# Altium project 组6-最终系统PCB.PrjPcb
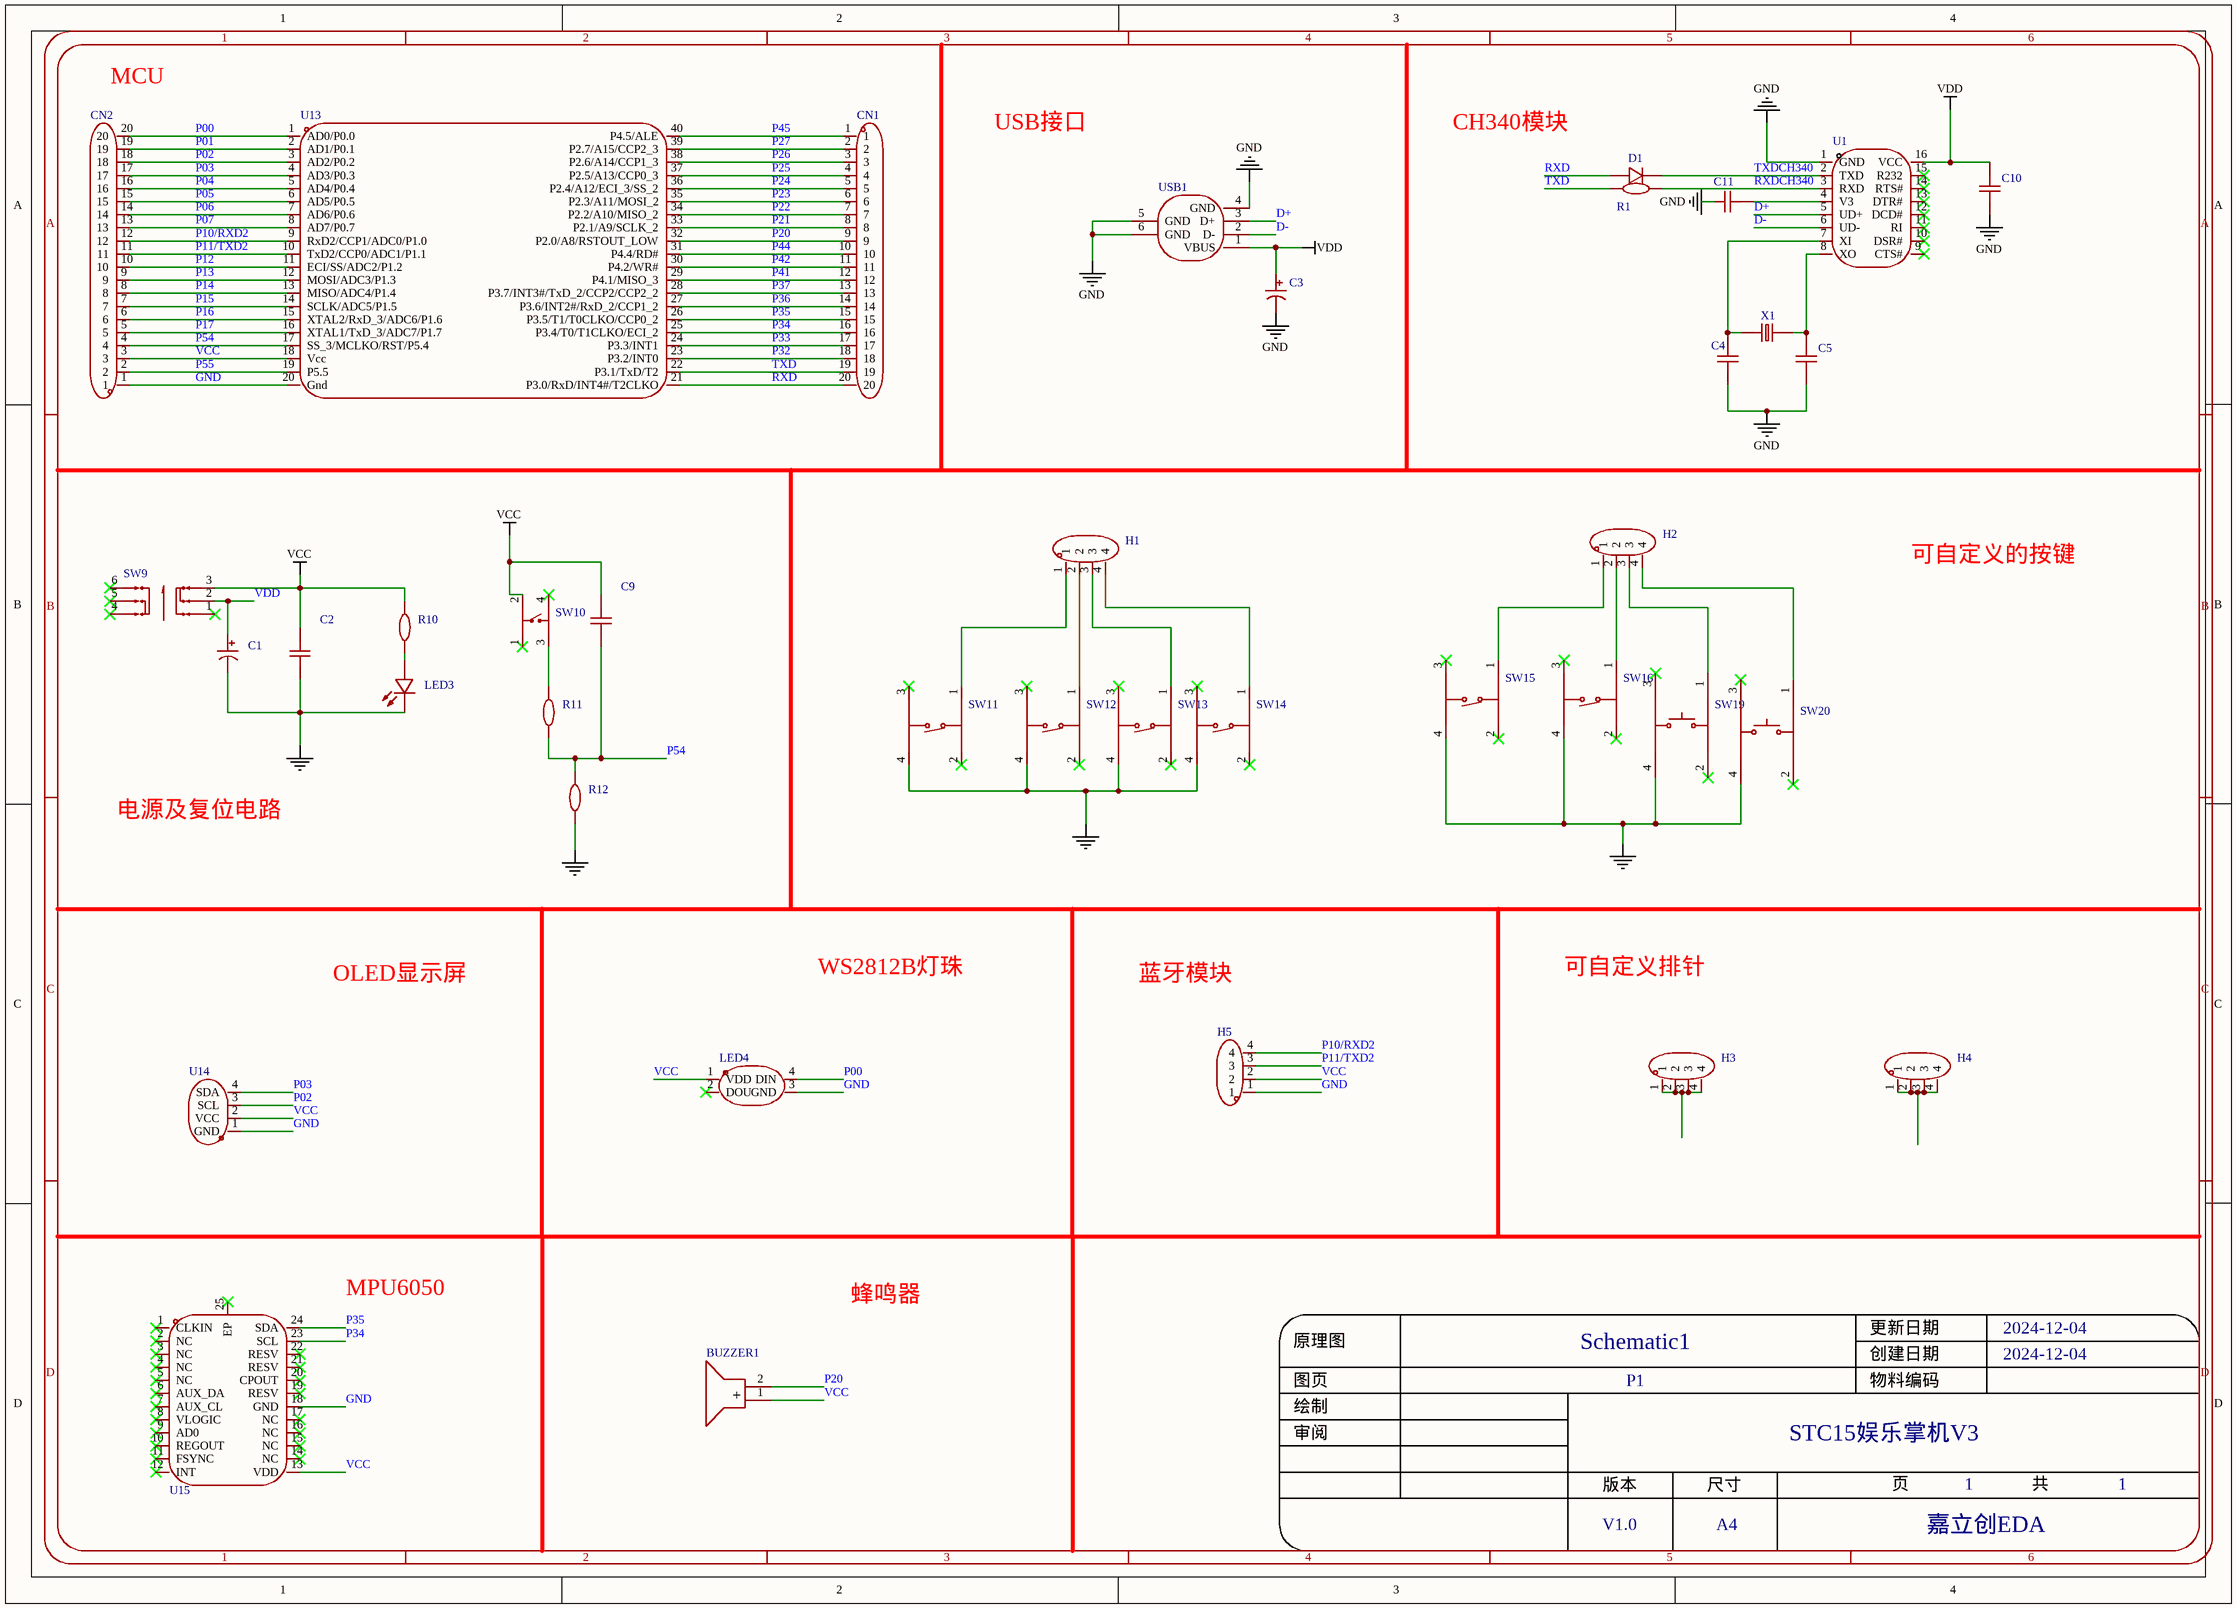
[diagram p0: P1.schdoc]
1 sheet, 39 parts. Net scope: global (net labels, ports and power ports of the same name join across sheets).
Board file: PCB1.pcbdoc

## Sheet P1.schdoc
size 431 x 309 mm; Symbol: Sheet-Symbol_A4; Device: Sheet-Symbol_A4; Company: 嘉立创EDA; Version: V1.0; Page Size: A4; @Project Name: STC15娱乐掌机V3; @Page Count: 1; @Update Date: 2024-12-04; @Create Date: 2024-12-04; @Schematic Name: Schematic1; @Page No: 1; @Page Name: P1; @Board Name: Board1; @Create Time: 14:28:36; @Update Time: 22:28:37; Width: 1655; Height: 1170; Region Start: 1; X Region Count: 6; Y Region Count: 4; Blade Width: 10; Title Block Position: 3

### Parts
BUZZER1  3kHz  [BUZ-TH_BD9.0-P5.00-D0.6-FD]  (value not drawn)
C1  220uF  [CAP-TH_BD6.3-P2.50-D1.0-FD]  (value not drawn)
C2  0.1uF  [CAP-TH_L5.0-W2.5-P5.08-D0.7]  (value not drawn)
C3  220uF/16V  [CAP-TH_BD6.3-P2.50-D1.0-FD]  (value not drawn)
C4  30pF  [CAP-TH_L5.0-W2.5-P2.54-D0.7]  (value not drawn)
C5  30pF  [CAP-TH_L5.0-W2.5-P2.54-D0.7]  (value not drawn)
C9  1uF  [CAP-TH_L5.0-W2.5-P5.08-D0.7]  (value not drawn)
C10  0.1uF/50V  [CAP-TH_L5.0-W2.5-P2.54-D0.7]  (value not drawn)
C11  0.1uF/50V  [CAP-TH_L5.0-W2.5-P2.54-D0.7]  (value not drawn)
CN1  1x20PIN  [hdr-th_20p-p2.54-v-m-4]  (value not drawn)
CN2  1x20PIN  [hdr-th_20p-p2.54-v-m-4]  (value not drawn)
D1  1N4148  [DO-35_BD2.0-L4.0-P8.00-D0.5-FD]  (value not drawn)
H1  PZ254V-11-04P  [HDR-TH_4P-P2.54-V-M]  (value not drawn)
H2  PZ254V-11-04P  [HDR-TH_4P-P2.54-V-M]  (value not drawn)
H3  PZ254V-11-04P  [HDR-TH_4P-P2.54-V-M]  (value not drawn)
H4  PZ254V-11-04P  [HDR-TH_4P-P2.54-V-M]  (value not drawn)
H5  蓝牙模块  [HDR-TH_4P-P2.54-V-M]  (value not drawn)
LED3  LED1  [LED-TH_BD4.0-P2.50-RD]  (value not drawn)
LED4  WS2812B  [LED-SMD_4P-L5.0-W5.0-BL_XL-5050RGBC]  (value not drawn)
R1  510  [RES-TH_BD1.7-L3.5-P7.50-D0.5]  (value not drawn)
R10  510Ω  [RES-TH_BD2.3-L3.7-P7.70-D0.9]  (value not drawn)
R11  510Ω  [RES-TH_BD2.3-L3.7-P7.70-D0.9]  (value not drawn)
R12  10kΩ  [RES-TH_BD2.3-L3.7-P7.70-D0.9]  (value not drawn)
SW9  XKB8080-Z  [SW-TH_6P-L8.0-W8.0-P2.50]  (value not drawn)
SW10  KH-6X6X4.3H-TJ  [SW-TH_4P-L6.0-W6.0-P4.50-LS6.5]  (value not drawn)
SW11  B3F-4005  [SW-TH_4P-L12.0-W12.0-P5.00-LS12.5-EH]  (value not drawn)
SW12  B3F-4005  [SW-TH_4P-L12.0-W12.0-P5.00-LS12.5-EH]  (value not drawn)
SW13  B3F-4005  [SW-TH_4P-L12.0-W12.0-P5.00-LS12.5-EH]  (value not drawn)
SW14  B3F-4005  [SW-TH_4P-L12.0-W12.0-P5.00-LS12.5-EH]  (value not drawn)
SW15  B3F-4005  [SW-TH_4P-L12.0-W12.0-P5.00-LS12.5-EH]  (value not drawn)
SW16  B3F-4005  [SW-TH_4P-L12.0-W12.0-P5.00-LS12.5-EH]  (value not drawn)
SW19  TC-1102-B-A-B  [SW-TH_4P-L6.0-W6.0-P4.50-LS6.5]  (value not drawn)
SW20  TC-1102-B-A-B  [SW-TH_4P-L6.0-W6.0-P4.50-LS6.5]  (value not drawn)
U1  CH340G  [SOIC-16_L9.9-W3.9-P1.27-LS6.0-BL]  (value not drawn)
U13  STC15F2K60S2-28I-PDIP40  [DIP-40_L52.3-W13.9-P2.54-LS15.2-BL]  (value not drawn)
U14  OLED  [OLED-TH_L27.8-W27.2-P2.54_C9900033791]  (value not drawn)
U15  MPU-6050  [QFN-24_L4.0-W4.0-P0.50-BL-EP2.7]  (value not drawn)
USB1  USB-B01  [USB-B-TH_USB-B01]  (value not drawn)
X1  12MHz  [HC-49US_L11.5-W4.5-P4.88]  (value not drawn)

### Nets
GND: C1.2 C2.1 C3.2 C4.1 C5.1 C10.1 C11.1 CN2.1 H5.1 LED3.1(C) LED4.3(GND) R12.1 SW11.4 SW12.4 SW13.4 SW14.4 SW15.4 SW16.4 SW19.4 SW20.4 U1.1(GND) U13.20(Gnd) U14.1(GND) U15.18(GND) USB1.4(GND) USB1.5(GND) USB1.6(GND)
VCC: BUZZER1.1(+) C2.2 C9.2 CN2.3 H5.2 LED4.1(VDD) R10.2 SW9.3 SW10.2 U13.18(Vcc) U14.2(VCC) U15.13(VDD)
VDD: C1.1 C3.1 C10.2 SW9.2 U1.16(VCC) USB1.1(VBUS)
D+: U1.5(UD+) USB1.3(D+)
D-: U1.6(UD-) USB1.2(D-)
P00: CN2.20 LED4.4(DIN) U13.1(AD0/P0.0)
P01: CN2.19 U13.2(AD1/P0.1)
P02: CN2.18 U13.3(AD2/P0.2) U14.3(SCL)
P03: CN2.17 U13.4(AD3/P0.3) U14.4(SDA)
P04: CN2.16 U13.5(AD4/P0.4)
P05: CN2.15 U13.6(AD5/P0.5)
P06: CN2.14 U13.7(AD6/P0.6)
P07: CN2.13 U13.8(AD7/P0.7)
P10/RXD2: CN2.12 H5.4 U13.9(RxD2/CCP1/ADC0/P1.0)
P11/TXD2: CN2.11 H5.3 U13.10(TxD2/CCP0/ADC1/P1.1)
P12: CN2.10 U13.11(ECI/SS/ADC2/P1.2)
P13: CN2.9 U13.12(MOSI/ADC3/P1.3)
P14: CN2.8 U13.13(MISO/ADC4/P1.4)
P15: CN2.7 U13.14(SCLK/ADC5/P1.5)
P16: CN2.6 U13.15(XTAL2/RxD_3/ADC6/P1.6)
P17: CN2.5 U13.16(XTAL1/TxD_3/ADC7/P1.7)
P20: BUZZER1.2(-) CN1.9 U13.32(P2.0/A8/RSTOUT_LOW)
P21: CN1.8 U13.33(P2.1/A9/SCLK_2)
P22: CN1.7 U13.34(P2.2/A10/MISO_2)
P23: CN1.6 U13.35(P2.3/A11/MOSI_2)
P24: CN1.5 U13.36(P2.4/A12/ECI_3/SS_2)
P25: CN1.4 U13.37(P2.5/A13/CCP0_3)
P26: CN1.3 U13.38(P2.6/A14/CCP1_3)
P27: CN1.2 U13.39(P2.7/A15/CCP2_3)
P32: CN1.18 U13.23(P3.2/INT0)
P33: CN1.17 U13.24(P3.3/INT1)
P34: CN1.16 U13.25(P3.4/T0/T1CLKO/ECI_2) U15.23(SCL)
P35: CN1.15 U13.26(P3.5/T1/T0CLKO/CCP0_2) U15.24(SDA)
P36: CN1.14 U13.27(P3.6/INT2#/RxD_2/CCP1_2)
P37: CN1.13 U13.28(P3.7/INT3#/TxD_2/CCP2/CCP2_2)
P41: CN1.12 U13.29(P4.1/MISO_3)
P42: CN1.11 U13.30(P4.2/WR#)
P44: CN1.10 U13.31(P4.4/RD#)
P45: CN1.1 U13.40(P4.5/ALE)
P54: C9.1 CN2.4 R11.1 R12.2 U13.17(SS_3/MCLKO/RST/P5.4)
P55: CN2.2 U13.19(P5.5)
RXD: CN1.20 D1.1(A) U13.21(P3.0/RxD/INT4#/T2CLKO)
RXDCH340: R1.2 U1.3(RXD)
TXD: CN1.19 R1.1 U13.22(P3.1/TxD/T2)
TXDCH340: D1.2(K) U1.2(TXD)
NetC4_2: C4.2 U1.7(XI) X1.1
NetC5_2: C5.2 U1.8(XO) X1.2
NetC11_2: C11.2 U1.4(V3)
NetH1_1: H1.1 SW11.1
NetH1_2: H1.2 SW12.1
NetH1_3: H1.3 SW13.1
NetH1_4: H1.4 SW14.1
NetH2_1: H2.1 SW15.1
NetH2_2: H2.2 SW16.1
NetH2_3: H2.3 SW19.1
NetH2_4: H2.4 SW20.1
NetH3_1: H3.1 H3.2 H3.3 H3.4
NetH4_1: H4.1 H4.2 H4.3 H4.4
NetLED3_2: LED3.2(A) R10.1
NetR11_2: R11.2 SW10.3

Not connected (* = marked no-connect by the designer): LED4 2(DOU)*; SW9 1* 4* 5* 6*; SW10 1* 4*; SW11 2* 3*; SW12 2* 3*; SW13 2* 3*; SW14 2* 3*; SW15 2* 3*; SW16 2* 3*; SW19 2* 3*; SW20 2* 3*; U1 9(CTS#)* 10(DSR#)* 11(RI)* 12(DCD#)* 13(DTR#)* 14(RTS#)* 15(R232)*; U15 1(CLKIN)* 2(NC)* 3(NC)* 4(NC)* 5(NC)* 6(AUX_DA)* 7(AUX_CL)* 8(VLOGIC)* 9(AD0)* 10(REGOUT)* 11(FSYNC)* 12(INT)* 14(NC)* 15(NC)* 16(NC)* 17(NC)* 19(RESV)* 20(CPOUT)* 21(RESV)* 22(RESV)* 25(EP)*

### Notes on the sheet
- (near CN2) MCU
- USB接口
- CH340模块
- 可自定义的按键
- 电源及复位电路
- WS2812B灯珠
- 可自定义排针
- OLED显示屏
- 蓝牙模块
- MPU6050
- 蜂鸣器
- 1
- 2
- 3
- 4
- 5
- 6
- A
- B
- C
- D
- 原理图
- Schematic1
- 创建日期
- 更新日期
- 2024-12-04
- 审阅
- 绘制
- 图页
- P1
- 物料编码
- STC15娱乐掌机V3
- 版本
- 尺寸
- 页
- 共
- V1.0
- A4
- 嘉立创EDA

### Library data of the parts
BUZZER1 = HNB09A03: 驱动方式:有源(内含驱动线路);构造类型:电磁式;频率:3kHz;声压(SPL):85dB@10cm;; Manufacturer: 华能; Add into BOM: yes; Technology Type: 电磁式; Operating Voltage: 1.5V~4.5V; Current Consumption: 30mA; Symbol: HNB09A03; Device: HNB09A03; LCSC Part Name: 电磁式有源一体蜂鸣器HNB09A03; Supplier Part: C96102; Manufacturer Part: HNB09A03; Supplier Footprint: 插件,D=9mm; JLCPCB Part Class: 扩展库; Datasheet: https://atta.szlcsc.com/upload/public/pdf/source/20170522/1495448326172.pdf; Supplier: LCSC; Convert to PCB: yes; Oscillator Circuit: 有源(内含驱动线路); Value: 3kHz; Sound Pressure Level (SPL): 85dB@10cm; Diameter (φD): 9mm; Length: -; Width: -; Height: 5.5mm; Operating Temperature: -20℃~+70℃
C1 = ZF227M010E07RR0VH4FP0: 容值:220uF;精度:±20%;额定电压:10V;纹波电流:-;等效串联电阻:-;; Manufacturer: CX(承兴); Symbol: 220uF 10V 6.3*7; Add into BOM: yes; Tolerance: ±20%; Rated Voltage: 10V; φD: 6.3mm; L: 7mm; Lifetime @ Temp: 1000hrs@105℃; Device: ZF227M010E07RR0VH4FP0; Supplier: LCSC; Manufacturer Part: ZF227M010E07RR0VH4FP0; Value: 220uF; Supplier Part: C43331; JLCPCB Part Class: 扩展库; LCSC Part Name: 220uF ±20% 10V 黑; Supplier Footprint: 插件,D6.3xL7mm; Datasheet: https://atta.szlcsc.com/upload/public/pdf/source/20211027/BC8F7E368CF510796C09133063E82C9C.pdf; Convert to PCB: yes; Ripple Current: -; Equivalent Series Resistance(ESR): -; Lead Spacing: 2.5mm; Operating Temperature: -40℃~+105℃
C2 C9 = CC1H330JC74DCH4B10MN: 容值:33pF;精度:±5%;额定电压:50V;温度系数:NP0;; Manufacturer: Dersonic(德尔创); Add into BOM: yes; Tolerance: ±5%; Voltage Rated: 50V; Temperature Coefficient: NP0; φD: 4.7mm; Body Thickness: 2.2mm; Symbol: CC1H330JC74DCH4B10MN; Device: CC1H330JC74DCH4B10MN; LCSC Part Name: 33pF ±5% 50V; Supplier Part: C254101; Manufacturer Part: CC1H330JC74DCH4B10MN; Supplier Footprint: 插件,P=5.08mm; JLCPCB Part Class: 扩展库; Datasheet: https://atta.szlcsc.com/upload/public/pdf/source/20200826/C254101_16B526CCB578B7B7F57569795E2616C1.pdf; Supplier: LCSC; Convert to PCB: yes; Lead Spacing: 5.08mm
  C2: Value: 0.1uF
  C9: Value: 1uF
C3 = 220uF/16V: Manufacturer: Lelon; Manufacturer Part: SS-101M1ASA-0605; Symbol: 100uF; Add into BOM: yes; Device: 220uF/16V; Supplier: LCSC; Supplier Part: C311676; JLCPCB Part Class: Extended Part; Convert to PCB: yes; Origin Footprint: CAP-TH_BD6.3-P2.50-D1.0-FD; Design Item ID: 100uF; Library Name: 51单片机SCH库 -v1
C4 C5 = 30pF: ±5% 50V  瓷片电容 直插; Manufacturer: FH; Manufacturer Part: CC4-0805N300J500F3; Add into BOM: yes; Symbol: 30pF; Device: 30pF; Supplier: LCSC; Supplier Part: C94716; JLCPCB Part Class: Extended Part; Convert to PCB: yes; Origin Footprint: CAP-TH_L5.0-W2.5-P2.54-D0.7; Design Item ID: 30pF; Library Name: 51单片机SCH库 -v1
C10 C11 = 0.1uF/50V: ±5% 50V  瓷片电容 直插; Manufacturer: FH; Manufacturer Part: CC4-0805N300J500F3; Symbol: 30pF; Add into BOM: yes; Device: 0.1uF/50V; Supplier: LCSC; Supplier Part: C94716; JLCPCB Part Class: Extended Part; Convert to PCB: yes; Origin Footprint: CAP-TH_L5.0-W2.5-P2.54-D0.7; Design Item ID: 30pF; Library Name: 51单片机SCH库 -v1
CN1 CN2 = HC-PZ254-11.5L-1x20PZ: 插针结构:1x20P;间距:2.54mm;行距:-;圆针/方针:方针;安装类型:直插;排数:单排;总PIN位数:20P;额定电流:3A;配合针长度:6mm;塑高:2.5mm;端接针长度:3mm;触头材质:黄铜;触头镀层:金;工作温度范围:-40℃~+105℃;焊接温度(最大值):260℃;颜色:黑色;; Manufacturer: HC(虹成电子); Add into BOM: yes; Pin Structure: 1x20P; Pitch: 2.54mm; Circluar Pins/Square Pins: 方针; Current Rating (Max): 3A; Soldering Temperature(Max): 260℃; Symbol: hc-pz254-11.5l-1x20pz; Device: HC-PZ254-11.5L-1x20PZ; LCSC Part Name: 间距2.54mm 1x20Pin 直插 H2.5 L11.5; Supplier Part: C27985199; Manufacturer Part: 1x20PIN; Supplier Footprint: 插件,P=2.54mm; JLCPCB Part Class: 扩展库; Datasheet: https://atta.szlcsc.com/upload/public/pdf/source/20240710/EBB73ACECFFBB056933A78571A4AC703.pdf; Supplier: LCSC; Convert to PCB: yes; Row Spacing: -; Mounting Type: 直插; Number of Rows: 单排; Number of Pins: 20P; Length of Mating Pin: 6mm; Insulation Height: 2.5mm; Length of End Connection Pin: 3mm; Contact Material: 黄铜; Contact Plating: 金; Operating Temperature Range: -40℃~+105℃; Color: 黑色
D1 = 1N4148: Manufacturer: ON Semicon; Add into BOM: yes; Symbol: 1N4148; Device: 1N4148; Supplier: LCSC; Supplier Part: C258182; Manufacturer Part: 1N4148; JLCPCB Part Class: Extended Part; Convert to PCB: yes; Origin Footprint: DO-35_BD2.0-L4.0-P8.00-D0.5-FD; Design Item ID: 1N4148; Library Name: 51单片机SCH库 -v1
H1-H5 = PZ254V-11-04P: 插针结构:1x4P;间距:2.54mm;行距:-;圆针/方针:方针;安装类型:直插;排数:单排;总PIN位数:4P;额定电流:3A;额定电压:250V;配合针长度:6mm;塑高:2.5mm;端接针长度:3mm;触头材质:-;工作温度范围:-40℃~+105℃;颜色:黑色;; Manufacturer: XFCN(兴飞); Symbol: PZ254V-11-04P_C2691448; Add into BOM: yes; Pin Structure: 1x4P; Pitch: 2.54mm; Circluar Pins/Square Pins: 方针; Current Rating (Max): 3A; Voltage Rating (Max): 250V; Device: PZ254V-11-04P; LCSC Part Name: 间距:2.54mm 1x4P 直插 方针; Supplier Part: C2691448; Supplier Footprint: 插件,P=2.54mm; JLCPCB Part Class: 扩展库; Datasheet: https://atta.szlcsc.com/upload/public/pdf/source/20200309/C492403_F9F19131791D08044AD4F84F8E751A34.pdf; Supplier: LCSC; Convert to PCB: yes; Row Spacing: -; Mounting Type: 直插; Number of Rows: 单排; Number of Pins: 4P; Length of Mating Pin: 6mm; Insulation Height: 2.5mm; Length of End Connection Pin: 3mm; Contact Material: -; Operating Temperature Range: -40℃~+105℃; Color: 黑色
  H1-H4: Manufacturer Part: PZ254V-11-04P
  H5: Manufacturer Part: 蓝牙模块
LED3 = 204-10SDRD/S530-A3/F182-68: -; Manufacturer: EVERLIGHT(亿光); Add into BOM: yes; Symbol: 204-10SDRD/S530-A3/F182-68; Device: 204-10SDRD/S530-A3/F182-68; Supplier: LCSC; Supplier Part: C473831; Manufacturer Part: LED1; JLCPCB Part Class: 扩展库; LCSC Part Name: 204-10SDRD/S530-A3/F182-68; Supplier Footprint: 插件; Convert to PCB: yes
LED4 = XL-5050RGBC-WS2812B: 5050七彩幻彩透明贴片LED灯珠 5050 幻彩透明四脚 ws2812B 内置驱动IC; Manufacturer: XINGLIGHT(成兴光); Add into BOM: yes; Symbol: XL-5050RGBC-WS2812B; Device: XL-5050RGBC-WS2812B; LCSC Part Name: XL-5050RGBC-WS2812B; Supplier Part: C2843785; Manufacturer Part: WS2812B; Supplier Footprint: SMD5050; JLCPCB Part Class: 扩展库; Datasheet: https://atta.szlcsc.com/upload/public/pdf/source/20240412/E1004CAA80592E31D08BFE019083806F.pdf; Supplier: LCSC; Convert to PCB: yes
R1 = 510/0.125W: 金属膜电阻/1/8W; Manufacturer: ResistorToday; Manufacturer Part: EWWR0008J4K70T9; Symbol: 4.7K; Add into BOM: yes; Device: 510/0.125W; Supplier: LCSC; Supplier Part: C349057; JLCPCB Part Class: Extended Part; Convert to PCB: yes; Origin Footprint: RES-TH_BD1.7-L3.5-P7.50-D0.5; Design Item ID: 4.7K; Library Name: 51单片机SCH库 -v1
R10-R12 = MF1/8W-330Ω±1%-OT52: 电阻类型:金属膜电阻;阻值:330Ω;精度:±1%;功率:125mW;温度系数:±350ppm/℃;; Manufacturer: VO(翔胜); Add into BOM: yes; Tolerance: ±1%; Overload Voltage (Max): 200V; Power(Watts): 125mW; Symbol: MF1/8W-330Ω±1%-OT52; Device: MF1/8W-330Ω±1%-OT52; LCSC Part Name: 金属膜电阻 330Ω ±1% 125mW; Supplier Part: C2848567; Manufacturer Part: MF1/8W-330Ω±1%-OT52; Supplier Footprint: 插件,D2.3xL3.7mm; JLCPCB Part Class: 扩展库; Supplier: LCSC; Convert to PCB: yes; Type: 金属膜电阻; Temperature Coefficient: ±350ppm/℃; Operating Temperature Range: -55℃~+155℃
  R10 R11: Value: 510Ω
  R12: Value: 10kΩ
SW9 = XKB8080-Z: 自锁/无锁:自锁;安装方式:直插;触点电流:100mA;额定电压 (AC):250V;额定电压 (DC):30V;带灯:不带;作用力:160gf;机械寿命:10万次;; Manufacturer: XKB Connectivity(中国星坤); Add into BOM: yes; Self Lock / No Lock: 自锁; Actuator Style: 矩形按钮; Contact Current: 100mA; Voltage Rating (AC): 250V; Voltage Rating (DC): 30V; Insulation Resistance: 100MΩ; Actuator/Cap Color: 蓝色; With Lamp: 不带; Pin Style: PC引脚; Operating Force: 160gf; Mechanical Life: 10万次; Symbol: XKB8080-Z; Device: XKB8080-Z; LCSC Part Name: 8*8 蓝白黑 自锁开关; Supplier Part: C318860; Manufacturer Part: XKB8080-Z; Supplier Footprint: 插件; JLCPCB Part Class: 扩展库; Datasheet: https://atta.szlcsc.com/upload/public/pdf/source/20200227/C318861_0CCDF4510CAD1098054D1FAD25282ED5.pdf; Supplier: LCSC; Convert to PCB: yes; IP Rating: -; Mounting Style: 直插; Operating Temperature: -15℃~+55℃
SW10 = KH-6X6X4.3H-TJ: 电路结构:单刀单掷;按钮形状:圆形按钮;作用力:260gf;安装方式:直插;开关长度:6mm;开关宽度:6mm;开关高度:4.3mm;带支架:不带;触点电流:50mA;额定电压(DC):12V;绝缘电阻:100MΩ;机械寿命:-;; Manufacturer: kinghelm(金航标); Add into BOM: yes; Circuit: 单刀单掷; Actuator Style: 圆形按钮; Operating Force: 260gf; Switch Length: 6mm; Switch Height: 4.3mm; Strike Gundam: 不带; Contact Current: 50mA; Voltage Rating (DC): 12V; Insulation Resistance: 100MΩ; Actuator/Cap Color: 黑色; Pin Style: PC引脚; Symbol: KH-6X6X4.3H-TJ; Device: KH-6X6X4.3H-TJ; Supplier: LCSC; Supplier Part: C2837514; Manufacturer Part: KH-6X6X4.3H-TJ; JLCPCB Part Class: 扩展库; LCSC Part Name: 6*6*4.3mm 直插 轻触开关; Supplier Footprint: 插件; Datasheet: https://atta.szlcsc.com/upload/public/pdf/source/20210608/C2837514_0D06B95E18851D47826D3A0BDAD15CC2.pdf; Convert to PCB: yes; Mounting Style: 直插; Switch Width: 6mm; Mechanical Life: -; Operating Temperature: -25℃~+70℃
SW11-SW16 = B3F-4005: 电路结构:单刀单掷;按钮形状:圆形按钮;安装方式:直插;开关长度:12mm;开关宽度:12mm;开关高度:4.3mm;带灯:-;机械寿命:-;; Manufacturer: OMRON(欧姆龙); Symbol: B3F-4005_C397283; Add into BOM: yes; Circuit: 单刀单掷; Actuator Style: 圆形按钮; Switch Length: 12mm; Switch Height: 4.3mm; Device: B3F-4005; LCSC Part Name: 12*12*4.3mm 直插 轻触开关; Supplier Part: C397283; Manufacturer Part: B3F-4005; Supplier Footprint: 插件,12x12mm; JLCPCB Part Class: 扩展库; Datasheet: https://atta.szlcsc.com/upload/public/pdf/source/20191212/C469135_90BE0DB612FA51D178D2ECFD00DF8DE6.pdf; Supplier: LCSC; Convert to PCB: yes; Mounting Style: 直插; Switch Width: 12mm; With Lamp: -; Mechanical Life: -
SW19 SW20 = TC-1102-B-A-B: 电路结构:单刀单掷;按钮形状:圆形按钮;作用力:160gf;安装方式:直插;开关长度:6mm;开关宽度:6mm;开关高度:4.3mm;带支架:不带;触点电流:50mA;额定电压(DC):12V;绝缘电阻:-;带灯:无;机械寿命:30万次;; Manufacturer: XKB Connectivity(中国星坤); Add into BOM: yes; Circuit: 单刀单掷; Actuator Style: 圆形按钮; Operating Force: 160gf; Switch Length: 6mm; Switch Height: 4.3mm; Strike Gundam: 不带; Contact Current: 50mA; Voltage Rating (DC): 12V; Actuator/Cap Color: 黑色; With Lamp: 无; Pin Style: PC引脚; Mechanical Life: 30万次; Symbol: TC-1102-B-A-B; Device: TC-1102-B-A-B; LCSC Part Name: 6*6*4.3mm 直插 轻触开关; Supplier Part: C480281; Manufacturer Part: TC-1102-B-A-B; Supplier Footprint: 插件; JLCPCB Part Class: 扩展库; Datasheet: https://atta.szlcsc.com/upload/public/pdf/source/20211011/5338952D91EAA82439B0E0118625537B.pdf; Supplier: LCSC; Convert to PCB: yes; Mounting Style: 直插; Switch Width: 6mm; Insulation Resistance: -; Operating Temperature: -30℃~+85℃
U1 = CH340G: Manufacturer: WCH; Add into BOM: yes; Symbol: CH340G; Device: CH340G; Supplier: LCSC; Manufacturer Part: CH340G; Supplier Part: C14267; JLCPCB Part Class: Basic Part; Convert to PCB: yes; Origin Footprint: SOIC-16_L9.9-W3.9-P1.27-LS6.0-BL; Design Item ID: CH340G; Library Name: 51单片机SCH库 -v1
U13 = STC15F2K60S2-28I-PDIP40: CPU内核:51系列;程序存储容量:60KB;RAM总容量:2KB;GPIO端口数量:38;工作电压范围:3.8V~5.5V;CPU最大主频:-;程序存储器类型:FLASH;; Manufacturer: STC(宏晶); Add into BOM: yes; CPU Core: 51系列; Program Storage Size: 60KB; RAM Size: 2KB; GPIO Ports Number: 38; Program Memory Type: FLASH; ADC (Bit): 10bit; 16Bit Timer: 3; UART/USART: 2; SPI: 1; Peripheral/Function: 低电压检测；看门狗；CCP捕获/比较; Watchdog: 有; Symbol: STC15F2K60S2-28I-PDIP40; Device: STC15F2K60S2-28I-PDIP40; Supplier: LCSC; Manufacturer Part: STC15F2K60S2-28I-PDIP40; Supplier Part: C57308; JLCPCB Part Class: 扩展库; LCSC Part Name: STC15F2K60S2-28I-PDIP40; Supplier Footprint: DIP-40; Datasheet: https://atta.szlcsc.com/upload/public/pdf/source/20170425/1493115792212.pdf; Convert to PCB: yes; Operating Voltage Range: 3.8V~5.5V; CPU Maximum Speed: -; Operating Temperature Range: -40℃~+85℃; DAC (Bit): -; PWM (Bit): -; 8Bit Timer: -; 32Bit Timer: -; CAN: -; I2C: -; I2S: -; Universal Serial Bus: -; Internal Comparator: -; communication protocol: -; Real-Time Clock: -; Infrared Data Association: -; Low-Voltage Detect: 有; CCP Capture/Compare: 有; Secure Digital Input and Output: -; Direct Memory Access: -; Internal Oscillator: 有
U14 = HS96L03W2C03: 主控芯片:SSD1315;接口类型:I2C;尺寸(inch):0.96;像素分辨率:128x64;; Manufacturer: HS(汉昇); Add into BOM: yes; Interface Type: I2C; Pixel Resolution: 128x64; Symbol: HS96L03W2C03; Device: HS96L03W2C03; LCSC Part Name: 0.96寸OLED显示屏窄白光IIC; Supplier Part: C5248080; Manufacturer Part: OLED; Supplier Footprint: -; JLCPCB Part Class: 扩展库; Datasheet: https://atta.szlcsc.com/upload/public/pdf/source/20230627/763D01F79A90007632F098068C7C8AD9.pdf; Supplier: LCSC; Convert to PCB: yes; Main Control Chip: SSD1315; Size: 0.96; Operating Temperature: -40℃~+70℃
U15 = MPU-6050: 传感器类型:加速度计陀螺仪;; Manufacturer: TDK InvenSense(应美盛); Symbol: MPU-6050_C24112; Add into BOM: yes; Device: MPU-6050; LCSC Part Name: MPU-6050; Supplier Part: C24112; Manufacturer Part: MPU-6050; Supplier Footprint: QFN-24-EP(4x4); JLCPCB Part Class: 扩展库; Datasheet: https://atta.szlcsc.com/upload/public/pdf/source/20140425/1457707046159.pdf; Supplier: LCSC; Convert to PCB: yes; Sensor Type: 加速度计陀螺仪; Operating Temperature: -40℃~+85℃
USB1 = USB-B01: 卧式B型USB连接器/母座 90度 USB-B01; Manufacturer: SOFNG; Add into BOM: yes; Symbol: USB-B01; Device: USB-B01; Supplier: LCSC; Supplier Part: C498173; Manufacturer Part: USB-B01; JLCPCB Part Class: Extended Part; Convert to PCB: yes; Origin Footprint: USB-B-TH_USB-B01; Design Item ID: USB-B01; Library Name: 51单片机SCH库 -v1
X1 = 12MHz: Manufacturer: TAE; Manufacturer Part: HC-49S12MHz20pF30PPM; Add into BOM: yes; Symbol: 12MHz; Device: 12MHz; Supplier: LCSC; Supplier Part: C127674; JLCPCB Part Class: Extended Part; Convert to PCB: yes; Origin Footprint: HC-49US_L11.5-W4.5-P4.88; Design Item ID: 12MHz; Library Name: 51单片机SCH库 -v1